# Altium schematic sheet ControllableClock.SchDoc: ARM2 to ARM3 Adapter
size A3; DocumentNumber: 1; SheetNumber: 1; SheetTotal: 1
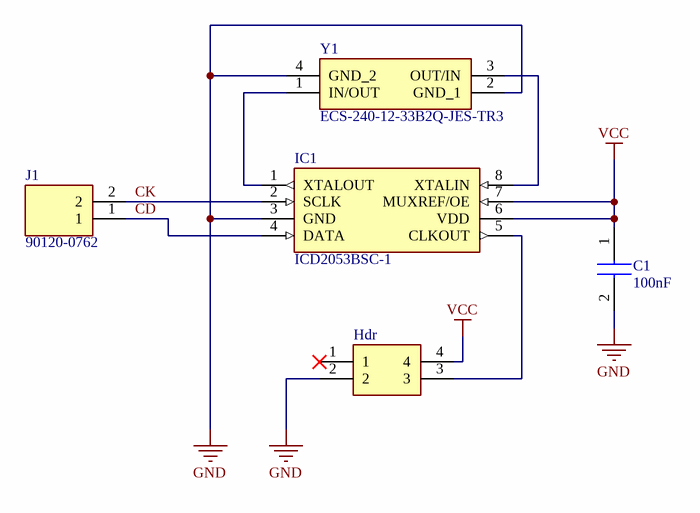
[diagram p0: ControllableClock.SchDoc]

## Parts
C1  100nF  [CAPC2012X145N]
Hdr  (no value)  [DIPS762W56P1524L1778H241Q4N]
IC1  ICD2053BSC-1  [SOIC127P602X173-8N]
J1  90120-0762  [HDRV2W35P0X254_1X2_508X249X560P]
Y1  ECS-240-12-33B2Q-JES-TR3  [ECS2401233B2QJESTR3]

## Nets
GND: C1.2 Hdr.2 IC1.3(GND) Y1.2(GND_1) Y1.4(GND_2)
VCC: C1.1 Hdr.4 IC1.6(VDD) IC1.7(MUXREF/OE)
CD: IC1.4(DATA) J1.1
CK: IC1.2(SCLK) J1.2
NetHdr_3: Hdr.3 IC1.5(CLKOUT)
NetIC1_1: IC1.1(XTALOUT) Y1.1(IN/OUT)
NetIC1_8: IC1.8(XTALIN) Y1.3(OUT/IN)

Not connected (* = marked no-connect by the designer): Hdr 1*

## Notes on the sheet
- SIZE
- CODION LTD
- DIMENSIONS
- TITLE
- VARIANT
- REVISION
- DATE
- A3
- SHEET
- OF
- FILE
- DRAWN BY

## Library data of the parts
C1 = C2012X7R1H104K125AM: Capacitor; Manufacturer_Name: TDK; Datasheet Link: https://product.tdk.com/info/en/catalog/datasheets/mlcc_commercial_midvoltage_en.pdf; Height: 1.45mm; Manufacturer_Part_Number: C2012X7R1H104K125AM; Mouser Part Number: 810-C2012X7R1H104KT5; Mouser Price/Stock: https://www.mouser.com/Search/Refine.aspx?Keyword=810-C2012X7R1H104KT5; Arrow Part Number: C2012X7R1H104K125AM; Arrow Price/Stock: https://www.arrow.com/en/products/c2012x7r1h104k125am/tdk
Hdr = 1107741: Header only; Manufacturer_Name: ARIES; Datasheet Link: http://docs-emea.rs-online.com/webdocs/13f3/0900766b813f3237.pdf; Height: 2.41mm; Manufacturer_Part_Number: 1107741; Mouser Part Number: 535-1107741; Mouser Price/Stock: https://www.mouser.co.uk/ProductDetail/Aries-Electronics/1107741?qs=WZRMhwwaLl%2FApwqojhfzdA%3D%3D
IC1 = ICD2053BSC-1: Integrated Circuit; Manufacturer_Name: Cypress Semiconductor; Datasheet Link: https://www.datasheetarchive.com/pdf/download.php?id=dd30b21a5d816c93cddfaa73a395283274a84c&type=M&term=ICD2053; Height: 1.727mm; Manufacturer_Part_Number: ICD2053BSC-1
J1 = 90120-0762: Connector; Manufacturer_Name: Molex; Datasheet Link: http://www.molex.com/pdm_docs/sd/901200762_sd.pdf; Height: 5.6mm; Manufacturer_Part_Number: 90120-0762; Mouser Part Number: 538-90120-0762; Mouser Price/Stock: https://www.mouser.co.uk/ProductDetail/Molex/90120-0762?qs=NKHyz0HolODkarWFh2VFww%3D%3D; Arrow Part Number: 90120-0762; Arrow Price/Stock: https://www.arrow.com/en/products/90120-0762/molex?region=nac
Y1 = ECS-240-12-33B2Q-JES-TR3: Crystal or Oscillator; Manufacturer_Name: ECS; Datasheet Link: https://ecsxtal.com/store/pdf/ECX-33B2Q.pdf; Height: 0.8mm; Manufacturer_Part_Number: ECS-240-12-33B2Q-JES-TR3